# EAGLE design IO (EAGLE 7.2.0)
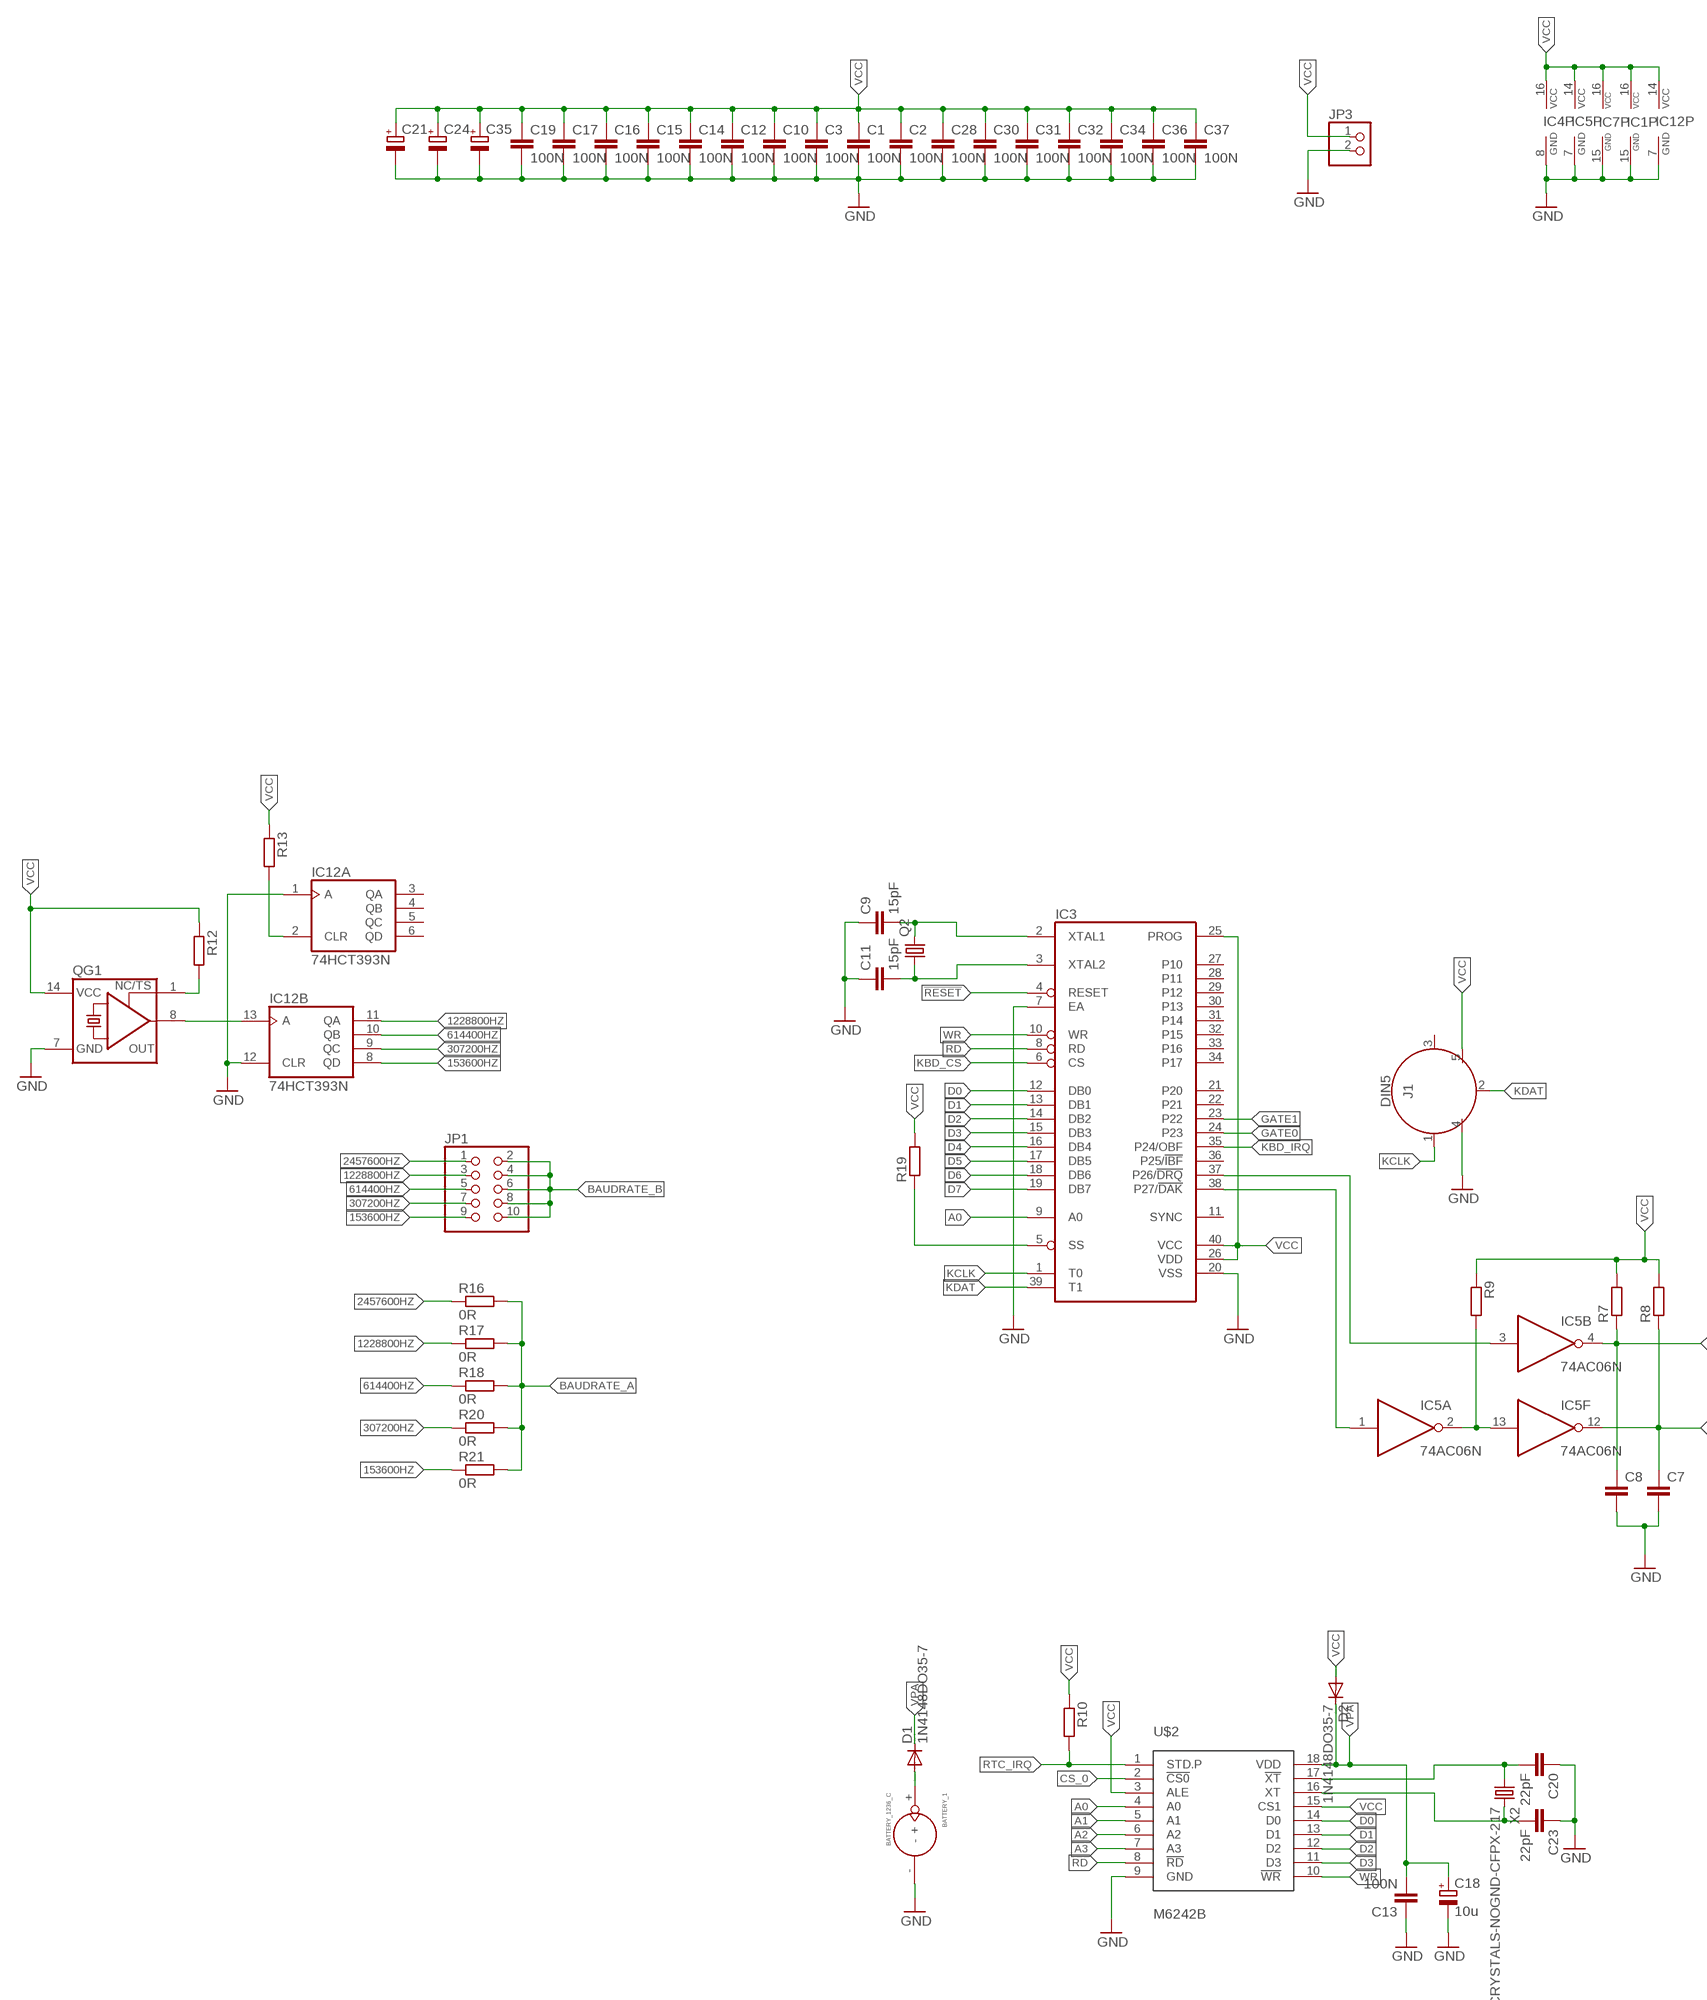
[diagram p0: schematic, sheet 1, part 1 of 3]
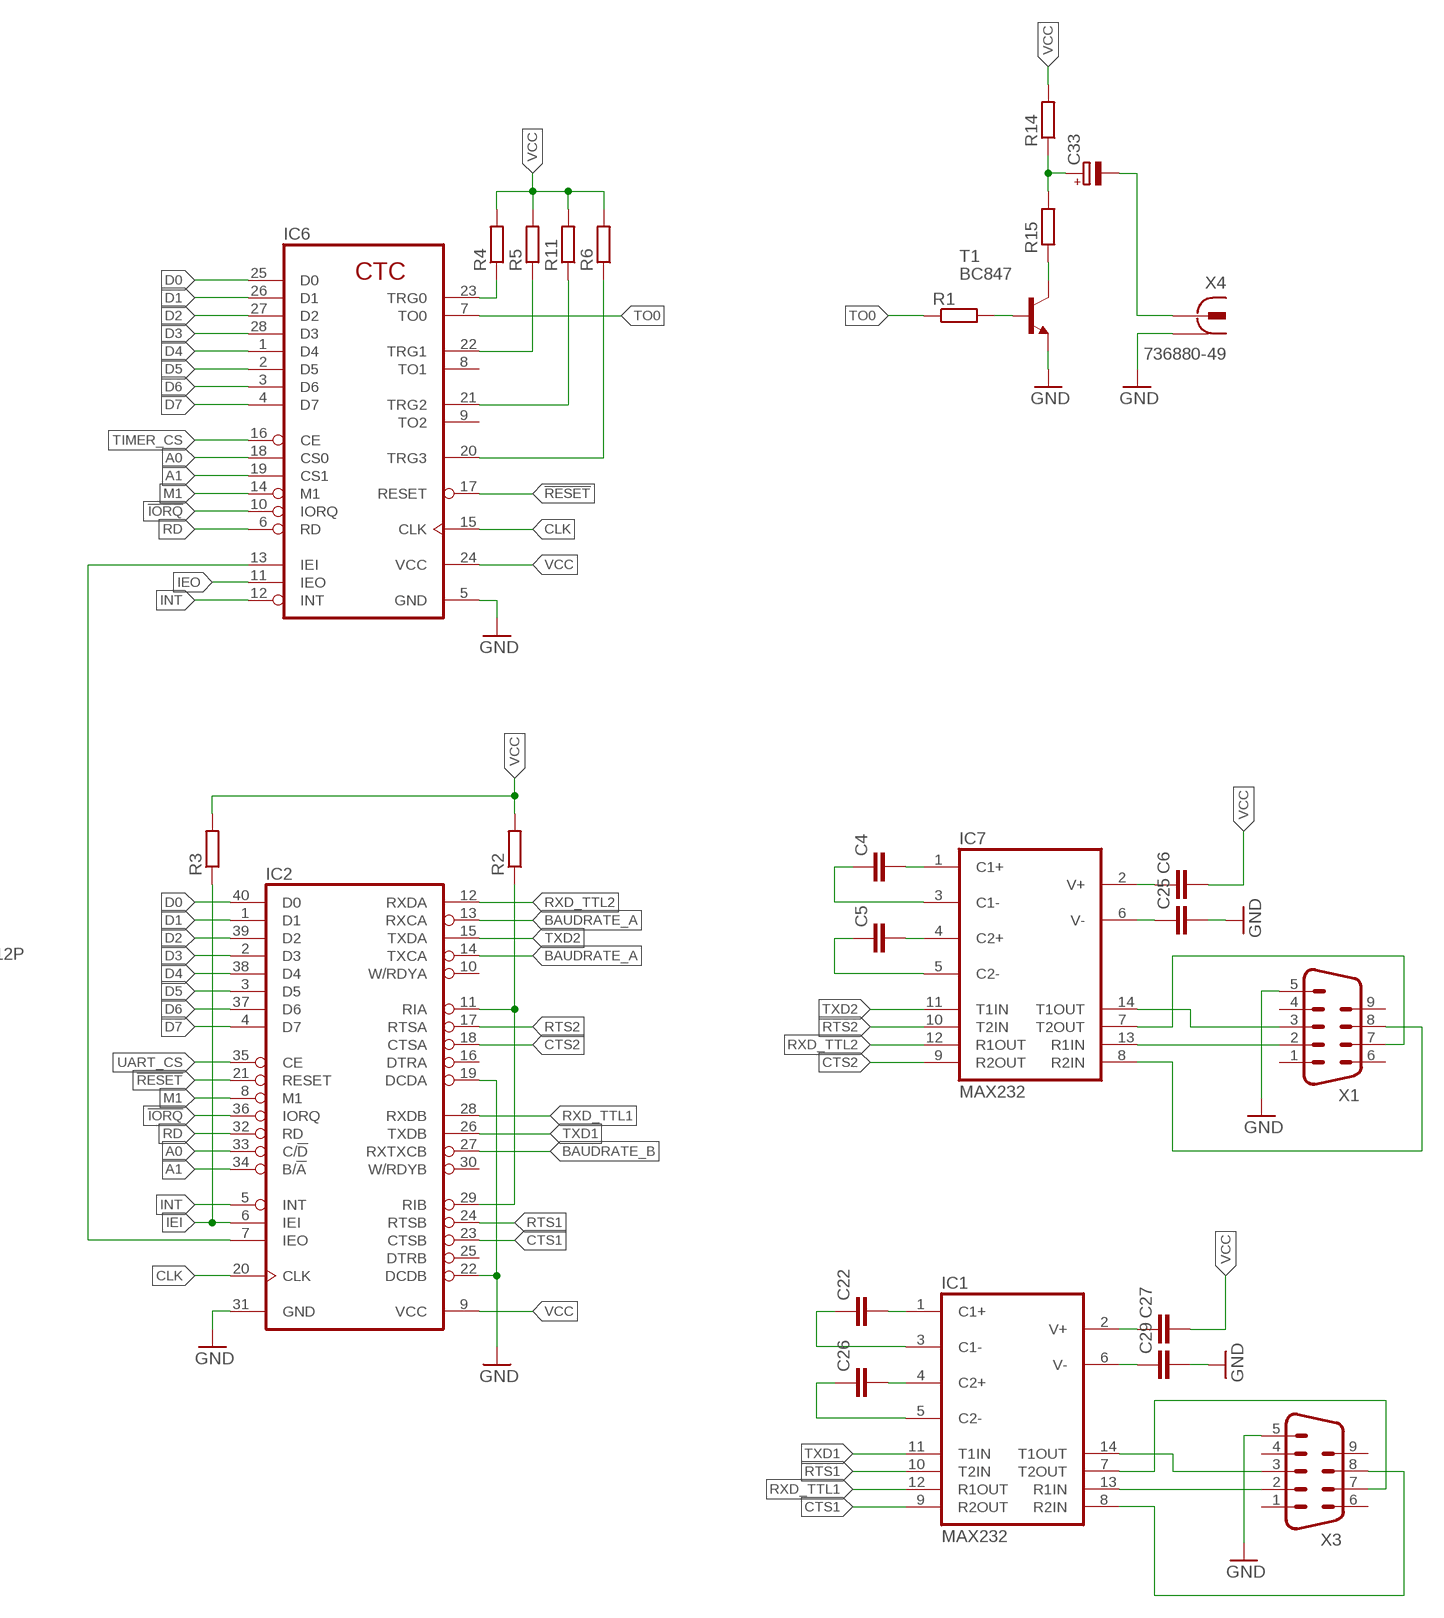
[diagram p1: schematic, sheet 1, part 2 of 3]
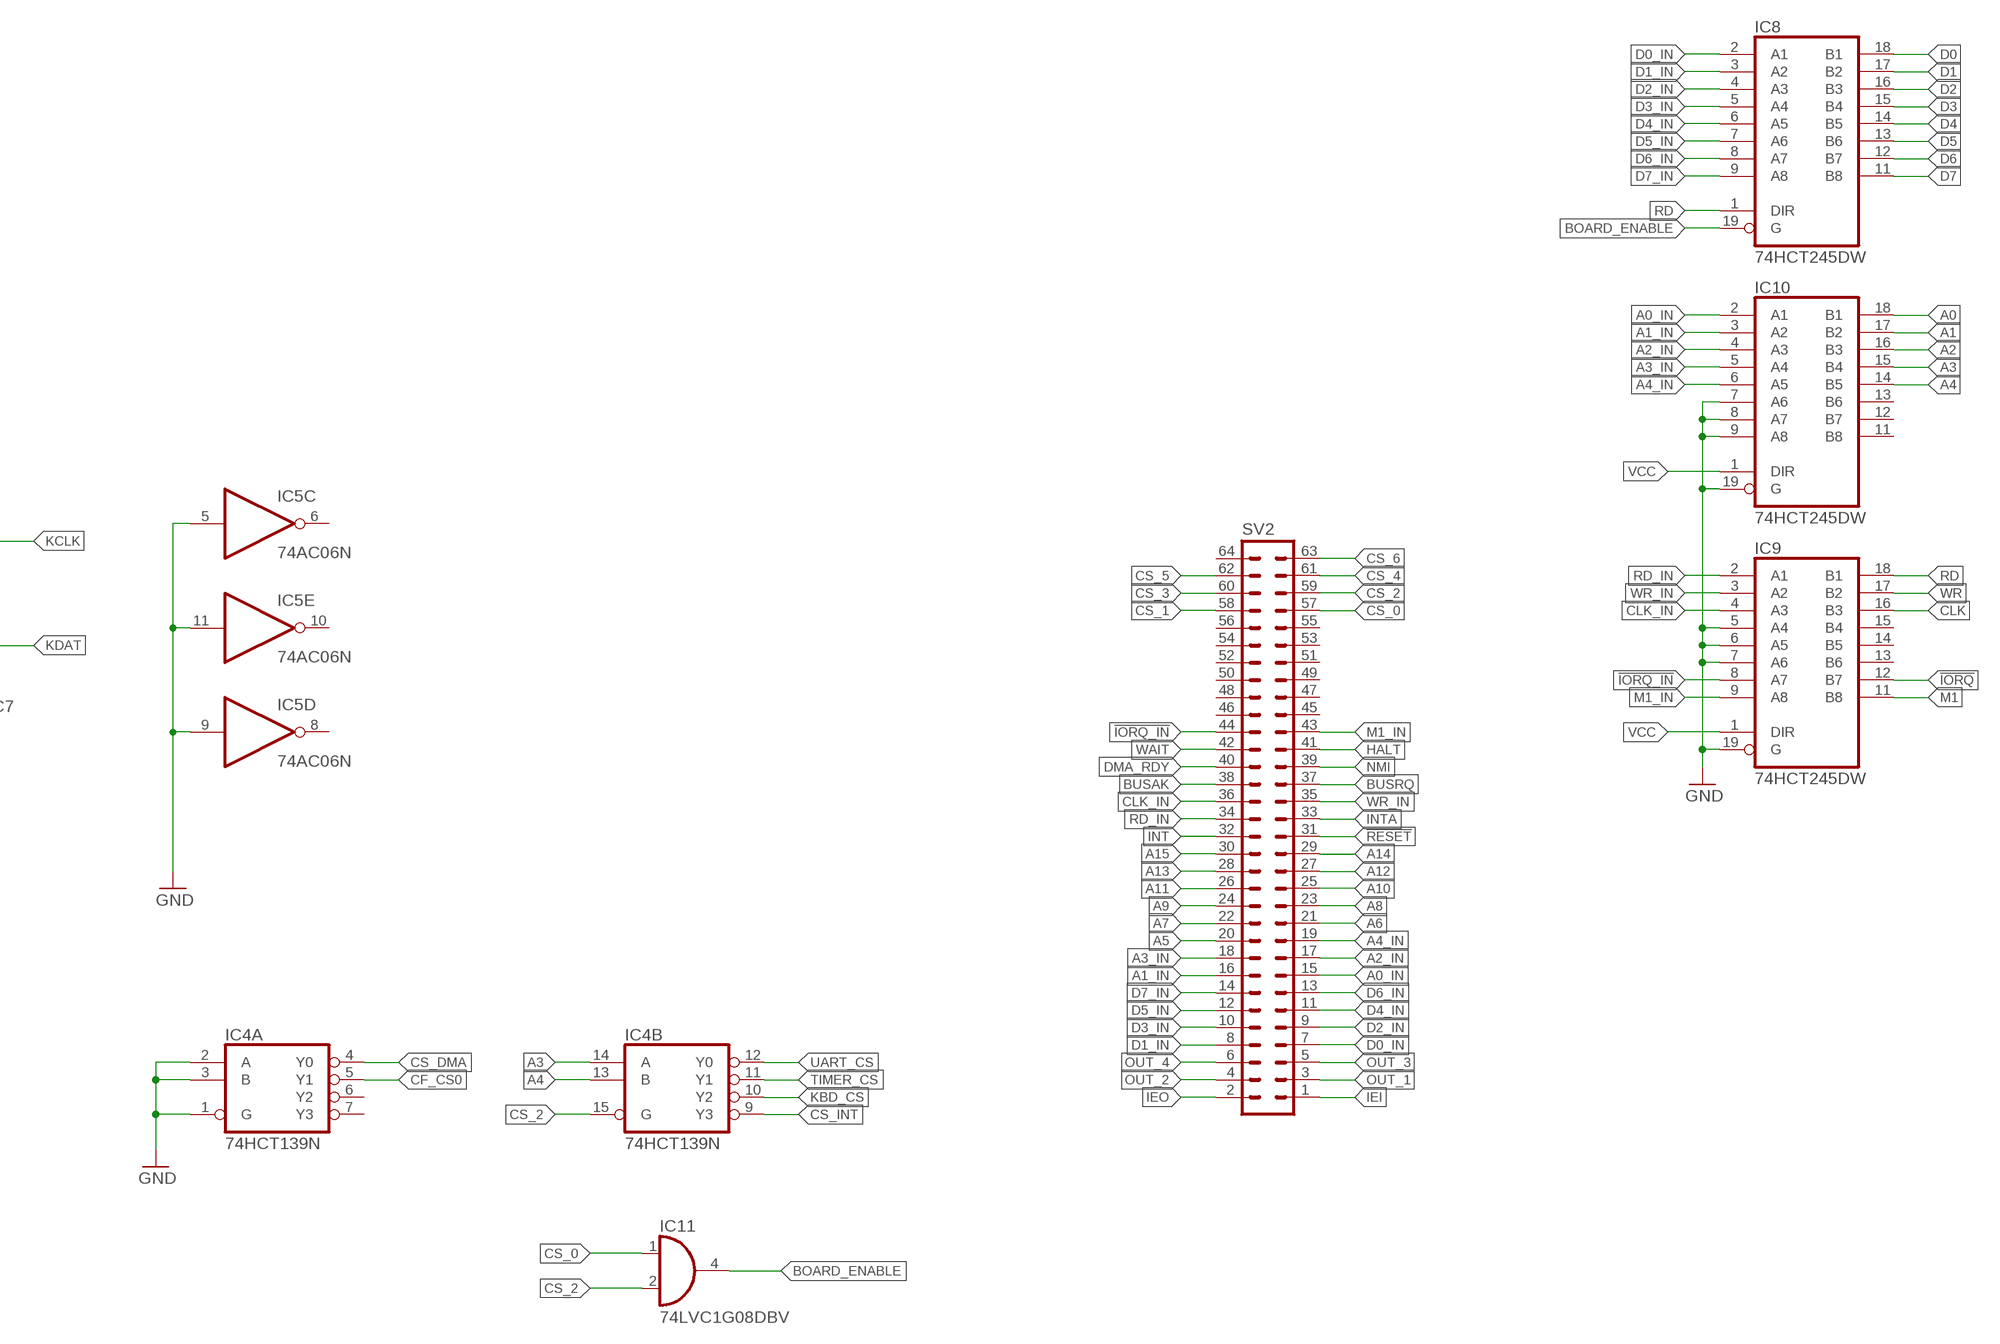
[diagram p2: schematic, sheet 1, part 3 of 3]

## Parts
BATTERY_1  BATTERY_1236_C  [BATTERY_1236_C]
C1  100N  C-EUC0603  [C0603]
C2  100N  C-EUC1206  [C1206]
C3  100N  C-EUC0603  [C0603]
C4  C-EUC0603  [C0603]
C5  C-EUC0603  [C0603]
C6  C-EUC0603  [C0603]
C7  C-EUC0603  [C0603]
C8  C-EUC0603  [C0603]
C9  15pF  C-EUC0603  [C0603]
C10  100N  C-EUC0603  [C0603]
C11  15pF  C-EUC0603  [C0603]
C12  100N  C-EUC0603  [C0603]
C13  100N  C-EUC0603  [C0603]
C14  100N  C-EUC0603  [C0603]
C15  100N  C-EUC0603  [C0603]
C16  100N  C-EUC0603  [C0603]
C17  100N  C-EUC0603  [C0603]
C18  10u  CPOL-EUSMCB  [SMC_B]
C19  100N  C-EUC0603  [C0603]
C20  22pF  C-EUC0603  [C0603]
C21  CPOL-EUSMCB  [SMC_B]
C22  C-EUC0603  [C0603]
C23  22pF  C-EUC0603  [C0603]
C24  CPOL-EUSMCB  [SMC_B]
C25  C-EUC0603  [C0603]
C26  C-EUC0603  [C0603]
C27  C-EUC0603  [C0603]
C28  100N  C-EUC0603  [C0603]
C29  C-EUC0603  [C0603]
C30  100N  C-EUC0603  [C0603]
C31  100N  C-EUC0603  [C0603]
C32  100N  C-EUC0603  [C0603]
C33  CPOL-EUE2-4  [E2-4]
C34  100N  C-EUC0603  [C0603]
C35  CPOL-EUE5-10.5  [E5-10,5]
C36  100N  C-EUC0603  [C0603]
C37  100N  C-EUC0603  [C0603]
D1  1N4148DO35-7  [DO35-7]
D2  1N4148DO35-7  [DO35-7]
IC1  MAX232  [DIL16]
IC2  Z80DART  [DIL40]
IC3  UPI-8042AH  [DIL40]
IC4  74HCT139N  [DIL16]
IC5  74AC06N  [DIL14]
IC6  Z80CTC  [DIL28]
IC7  MAX232  [DIL16]
IC8  74HCT245DW  [SO20W]
IC9  74HCT245DW  [SO20W]
IC10  74HCT245DW  [SO20W]
IC11  74LVC1G08DBV  [SOT23-5]
IC12  74HCT393N  [DIL14]
J1  DIN5  [DIN5-RA-PTH]
JP1  PINHD-2X5  [2X05]
JP3  PINHD-1X2/90  [1X02/90]
Q2  CRYSTALHC49S  [HC49/S]
QG1  XO-14  [DIL14S]
R1  R-EU_R0603  [R0603]
R2  R-EU_R0603  [R0603]
R3  R-EU_0204/5  [0204/5]
R4  R-EU_R0603  [R0603]
R5  R-EU_R0603  [R0603]
R6  R-EU_0204/5  [0204/5]
R7  R-EU_0204/7  [0204/7]
R8  R-EU_M0805  [M0805]
R9  R-EU_R0603  [R0603]
R10  R-EU_R0603  [R0603]
R11  R-EU_R0603  [R0603]
R12  R-EU_R0603  [R0603]
R13  R-EU_R0603  [R0603]
R14  R-EU_0204/7  [0204/7]
R15  R-EU_R0603  [R0603]
R16  0R  R-EU_R0603  [R0603]
R17  0R  R-EU_R0603  [R0603]
R18  0R  R-EU_R0603  [R0603]
R19  R-EU_0204/5  [0204/5]
R20  0R  R-EU_R0603  [R0603]
R21  0R  R-EU_R0603  [R0603]
SV2  ML64L  [ML64L]
T1  BC847  [SOT23]
U$2  M6242B  [DIL18]
X1  M09HP  [M09HP]
X2  CRYSTALS-NOGND-CFPX-217  [3.2X1.5-2-PAD]
X3  M09HP  [M09HP]
X4  736880-49  [736880-49]

## Nets
153600HZ: IC12.8(B:QD) JP1.9 R21.1
307200HZ: IC12.9(B:QC) JP1.7 R20.1
614400HZ: IC12.10(B:QB) JP1.5 R18.1
1228800HZ: IC12.11(B:QA) JP1.3 R17.1
2457600HZ: IC12.13(B:A) JP1.1 QG1.8(OUT) R16.1
!IORQ: IC2.36(IORQ) IC6.10(IORQ) IC9.12(B7)
!IORQ_IN: IC9.8(A7) SV2.44
!RESET: IC2.21(RESET) IC3.4(RESET) IC6.17(RESET) SV2.31
A0: IC2.33(C/!D) IC3.9(A0) IC6.18(CS0) IC10.18(B1) U$2.4(A0)
A0_IN: IC10.2(A1) SV2.15
A1: IC2.34(B/!A) IC6.19(CS1) IC10.17(B2) U$2.5(A1)
A1_IN: IC10.3(A2) SV2.16
A2: IC10.16(B3) U$2.6(A2)
A2_IN: IC10.4(A3) SV2.17
A3: IC4.14(B:A) IC10.15(B4) U$2.7(A3)
A3_IN: IC10.5(A4) SV2.18
A4: IC4.13(B:B) IC10.14(B5)
A4_IN: IC10.6(A5) SV2.19
A5: SV2.20
A6: SV2.21
A7: SV2.22
A8: SV2.23
A9: SV2.24
A10: SV2.25
A11: SV2.26
A12: SV2.27
A13: SV2.28
A14: SV2.29
A15: SV2.30
BAUDRATE_A: IC2.13(RXCA) IC2.14(TXCA) R16.2 R17.2 R18.2 R20.2 R21.2
BAUDRATE_B: IC2.27(RXTXCB) JP1.2 JP1.4 JP1.6 JP1.8 JP1.10
BOARD_ENABLE: IC8.19(G) IC11.4(O)
BUSAK: SV2.38
BUSRQ: SV2.37
CF_CS0: IC4.5(A:Y1)
CLK: IC2.20(CLK) IC6.15(CLK) IC9.16(B3)
CLK_IN: IC9.4(A3) SV2.36
CS_0: IC11.1(I0) SV2.57 U$2.2(!CS0)
CS_1: SV2.58
CS_2: IC4.15(B:G) IC11.2(I1) SV2.59
CS_3: SV2.60
CS_4: SV2.61
CS_5: SV2.62
CS_6: SV2.63
CS_DMA: IC4.4(A:Y0)
CS_INT: IC4.9(B:Y3)
CTS1: IC1.9(R2OUT) IC2.23(CTSB)
CTS1_IN: IC1.8(R2IN) X3.8
CTS2: IC2.18(CTSA) IC7.9(R2OUT)
D0: IC2.40(D0) IC3.12(DB0) IC6.25(D0) IC8.18(B1) U$2.14(D0)
D0_IN: IC8.2(A1) SV2.7
D1: IC2.1(D1) IC3.13(DB1) IC6.26(D1) IC8.17(B2) U$2.13(D1)
D1_IN: IC8.3(A2) SV2.8
D2: IC2.39(D2) IC3.14(DB2) IC6.27(D2) IC8.16(B3) U$2.12(D2)
D2_IN: IC8.4(A3) SV2.9
D3: IC2.2(D3) IC3.15(DB3) IC6.28(D3) IC8.15(B4) U$2.11(D3)
D3_IN: IC8.5(A4) SV2.10
D4: IC2.38(D4) IC3.16(DB4) IC6.1(D4) IC8.14(B5)
D4_IN: IC8.6(A5) SV2.11
D5: IC2.3(D5) IC3.17(DB5) IC6.2(D5) IC8.13(B6)
D5_IN: IC8.7(A6) SV2.12
D6: IC2.37(D6) IC3.18(DB6) IC6.3(D6) IC8.12(B7)
D6_IN: IC8.8(A7) SV2.13
D7: IC2.4(D7) IC3.19(DB7) IC6.4(D7) IC8.11(B8)
D7_IN: IC8.9(A8) SV2.14
DMA_RDY: SV2.40
GATE0: IC3.24(P23)
GATE1: IC3.23(P22)
GND: BATTERY_1.- C1.2 C2.2 C3.2 C7.2 C8.2 C9.1 C10.2 C11.1 C12.2 C13.1 C14.2 C15.2 C16.2 C17.2 C18.- C19.2 C20.1 C21.- C23.1 C24.- C25.2 C28.2 C29.2 C30.2 C31.2 C32.2 C34.2 C35.- C36.2 C37.2 IC1.15(GND) IC2.19(DCDA) IC2.22(DCDB) IC2.31(GND) IC3.7(EA) IC3.20(VSS) IC4.1(A:G) IC4.2(A:A) IC4.3(A:B) IC4.8(P:GND) IC5.5(C:I) IC5.7(P:GND) IC5.9(D:I) IC5.11(E:I) IC6.5(GND) IC7.15(GND) IC9.5(A4) IC9.6(A5) IC9.7(A6) IC9.19(G) IC10.7(A6) IC10.8(A7) IC10.9(A8) IC10.19(G) IC12.1(A:A) IC12.7(P:GND) IC12.12(B:CLR) J1.4 JP3.2 QG1.7(GND) T1.2(E) U$2.9(GND) X1.5 X3.5 X4.1 X4.1@1 X4.1@2
HALT: SV2.41
IEI: IC2.6(IEI) R3.1 SV2.1
IEO: IC6.11(IEO) SV2.2
INT: IC2.5(INT) IC6.12(INT) SV2.32
INTA: SV2.33
KBD_CS: IC3.6(CS) IC4.10(B:Y2)
KBD_IRQ: IC3.35(P24/OBF)
KCLK: C8.1 IC3.1(T0) IC5.4(B:O) J1.1 R7.1
KDAT: C7.1 IC3.39(T1) IC5.12(F:O) J1.2 R8.1
M1: IC2.8(M1) IC6.14(M1) IC9.11(B8)
M1_IN: IC9.9(A8) SV2.43
N$1: IC1.7(T2OUT) X3.7
N$2: C22.2 IC1.1(C1+)
N$3: IC3.38(P27/!DAK) IC5.1(A:I)
N$4: C26.2 IC1.4(C2+)
N$5: C26.1 IC1.5(C2-)
N$6: C22.1 IC1.3(C1-)
N$7: IC7.7(T2OUT) X1.7
N$8: IC7.13(R1IN) X1.2
N$9: C4.2 IC7.1(C1+)
N$10: C5.2 IC7.4(C2+)
N$11: C5.1 IC7.5(C2-)
N$12: C4.1 IC7.3(C1-)
N$13: C6.1 IC7.2(V+)
N$14: C25.1 IC7.6(V-)
N$15: C9.2 IC3.2(XTAL1) Q2.2
N$16: C11.2 IC3.3(XTAL2) Q2.1
N$17: IC3.37(P26/!DRQ) IC5.3(B:I)
N$18: IC7.14(T1OUT) X1.3
N$19: C27.1 IC1.2(V+)
N$20: IC5.2(A:O) IC5.13(F:I) R9.2
N$21: IC1.13(R1IN) X3.2
N$22: BATTERY_1.+ D1.A
N$26: R1.2 T1.1(B)
N$27: R15.1 T1.3(C)
N$28: IC7.8(R2IN) X1.8
N$29: C29.1 IC1.6(V-)
N$30: C33.- X4.2
N$31: IC6.22(TRG1) R5.1
N$32: IC2.7(IEO) IC6.13(IEI)
N$33: IC6.23(TRG0) R4.1
N$34: QG1.1(TS) R12.2
N$35: IC3.5(SS) R19.1
N$36: IC2.11(RIA) IC2.29(RIB) R2.1
N$38: IC6.20(TRG3) R6.1
N$39: IC6.21(TRG2) R11.1
N$40: C33.+ R14.1 R15.2
N$41: IC12.2(A:CLR) R13.2
NMI: SV2.39
OUT_1: SV2.3
OUT_2: SV2.4
OUT_3: SV2.5
OUT_4: SV2.6
RD: IC2.32(RD) IC3.8(RD) IC6.6(RD) IC8.1(DIR) IC9.18(B1) U$2.8(!RD)
RD_IN: IC9.2(A1) SV2.34
RTC_IRQ: R10.2 U$2.1(STD.P)
RTS1: IC1.10(T2IN) IC2.24(RTSB)
RTS2: IC2.17(RTSA) IC7.10(T2IN)
RXD_TTL1: IC1.12(R1OUT) IC2.28(RXDB)
RXD_TTL2: IC2.12(RXDA) IC7.12(R1OUT)
SOSCI: C20.2 U$2.17(!XT) X2.1
SOSCO: C23.2 U$2.16(XT) X2.2
TIMER_CS: IC4.11(B:Y1) IC6.16(CE)
TO0: IC6.7(TO0) R1.1
TXD1: IC1.11(T1IN) IC2.26(TXDB)
TXD1_OUT: IC1.14(T1OUT) X3.3
TXD2: IC2.15(TXDA) IC7.11(T1IN)
UART_CS: IC2.35(CE) IC4.12(B:Y0)
VCC: C1.1 C2.1 C3.1 C6.2 C10.1 C12.1 C14.1 C15.1 C16.1 C17.1 C19.1 C21.+ C24.+ C27.2 C28.1 C30.1 C31.1 C32.1 C34.1 C35.+ C36.1 C37.1 D2.A IC1.16(VCC) IC2.9(VCC) IC3.25(PROG) IC3.26(VDD) IC3.40(VCC) IC4.16(P:VCC) IC5.14(P:VCC) IC6.24(VCC) IC7.16(VCC) IC9.1(DIR) IC10.1(DIR) IC12.14(P:VCC) J1.5 JP3.1 QG1.14(VCC) R2.2 R3.2 R4.2 R5.2 R6.2 R7.2 R8.2 R9.1 R10.1 R11.2 R12.1 R13.1 R14.2 R19.2 U$2.3(ALE) U$2.15(CS1)
VPA: C13.2 C18.+ D1.C D2.C U$2.18(VDD)
WAIT: SV2.42
WR: IC3.10(WR) IC9.17(B2) U$2.10(!WR)
WR_IN: IC9.3(A2) SV2.35
Unconnected: IC2.10(W/RDYA) IC2.16(DTRA) IC2.25(DTRB) IC2.30(W/RDYB) IC3.11(SYNC) IC3.21(P20) IC3.22(P21) IC3.27(P10) IC3.28(P11) IC3.29(P12) IC3.30(P13) IC3.31(P14) IC3.32(P15) IC3.33(P16) IC3.34(P17) IC3.36(P25/!IBF) IC4.6(A:Y2) IC4.7(A:Y3) IC5.6(C:O) IC5.8(D:O) IC5.10(E:O) IC6.8(TO1) IC6.9(TO2) IC9.13(B6) IC9.14(B5) IC9.15(B4) IC10.11(B8) IC10.12(B7) IC10.13(B6) IC12.3(A:QA) IC12.4(A:QB) IC12.5(A:QC) IC12.6(A:QD) J1.3 SV2.45 SV2.46 SV2.47 SV2.48 SV2.49 SV2.50 SV2.51 SV2.52 SV2.53 SV2.54 SV2.55 SV2.56 SV2.64 X1.1 X1.4 X1.6 X1.9 X3.1 X3.4 X3.6 X3.9

## Power pins joined to a net without a drawn wire
GND: IC8.10(GND) IC9.10(GND) IC10.10(GND) IC11.3(GND)
VCC: IC8.20(VCC) IC9.20(VCC) IC10.20(VCC) IC11.5(VCC)

## Library data of the parts
BATTERY_1 = Itead_BP_110825.lbr:BATTERY_1236_C: SOC004
C1-C17 C19 C20 C22 C23 C25-C32 C34 C36 C37 = rcl:C-EU: CAPACITOR, European symbol
C18 C21 C24 C33 C35 = rcl:CPOL-EU: POLARIZED CAPACITOR, European symbol
D1 D2 = diode:1N4148: DIODE high speed (Philips)
IC1 IC7 = maxim:MAX232: RS232 TRANSCEIVER; MF: MAXIM; MPN: MAX232ACPE+; OC_FARNELL: 9723773; OC_NEWARK: 68K4544
IC2 = zilog:Z80DART: Z80 FAMILY DEVICE
IC3 = micro-intel:UPI-8042AH: MICROCOMPUTER/PERIPHERAL DEVICE; OC_FARNELL: unknown; OC_NEWARK: unknown
IC4 = 74xx-eu:74*139: Dual 2-line to 4-line DECODER/DEMULTIPLEXER
IC5 = 74xx-eu:74*06: Hex INVERTER, open collector high-voltage output
IC6 = zilog:Z80CTC: Z80 FAMILY DEVICE
IC8-IC10 = 74xx-eu:74*245: Octal BUS TRANSCEIVER, 3-state
IC11 = 74xx-little-de:74*1G08: 2-input AND gate
IC12 = 74xx-eu:74*393: Dual 4-bit decade and binary COUNTER
J1 = SparkFun-Connectors:DIN5: DIN5 Connector - Female Right Angle (frequently used as a MIDI Jack connector) This type of connector and cable is frequently used for transmitting midi data (musical instrument digital interface). It is what you usually see on a keyboard or set of electronic drums. Learn more here <https://en.wikipedia.org/wiki/MIDI>. For more information on the pinout and electrical specifications of MIDI communications, please see the following resource: https://www.midi.org/specifications/item/midi-din-electrical-specification Here is the connector we sell at SparkFun: MIDI Connector - Female Right Angle <https://www.sparkfun.com/products/9536> (PRT-09536) Datasheet <hhttp://www.sparkfun.com/datasheets/Prototyping/Connectors/MIDI-RA.pdf> It is used on this SparkFun product: SparkFun MIDI Shield <https://www.sparkfun.com/products/12898> (DEV-12898); PROD_ID: CONN-09481
JP1 = pinhead:PINHD-2X5: PIN HEADER
JP3 = pinhead:PINHD-1X2: PIN HEADER
Q2 = crystal:CRYSTAL: CRYSTAL; OC_FARNELL: 1667008; OC_NEWARK: unknown
QG1 = crystal:XO-: CRYSTAL; OC_FARNELL: unknown; OC_NEWARK: unknown
R1-R21 = rcl:R-EU_: RESISTOR, European symbol
SV2 = con-harting-ml:ML64: HARTING; OC_FARNELL: unknown; OC_NEWARK: unknown
T1 = transistor:BC847: NPN TRANSISTOR
U$2 = mw:M6242B
X1 X3 = con-subd:M09: SUB-D; OC_FARNELL: unknown; OC_NEWARK: unknown
X2 = IQD-Frequency-Products:CRYSTALS-NOGND: CRYSTALS CAN NOT GROUNDED
X4 = con-conrad:736880-49: Cinch Connector ( RCA Jack ) Cinch-Einbaukupplung 90º 72345 Vernickelt BKL Electronic Source: Conrad <http://www.conrad.de/ce/de/product/736880>

## Board
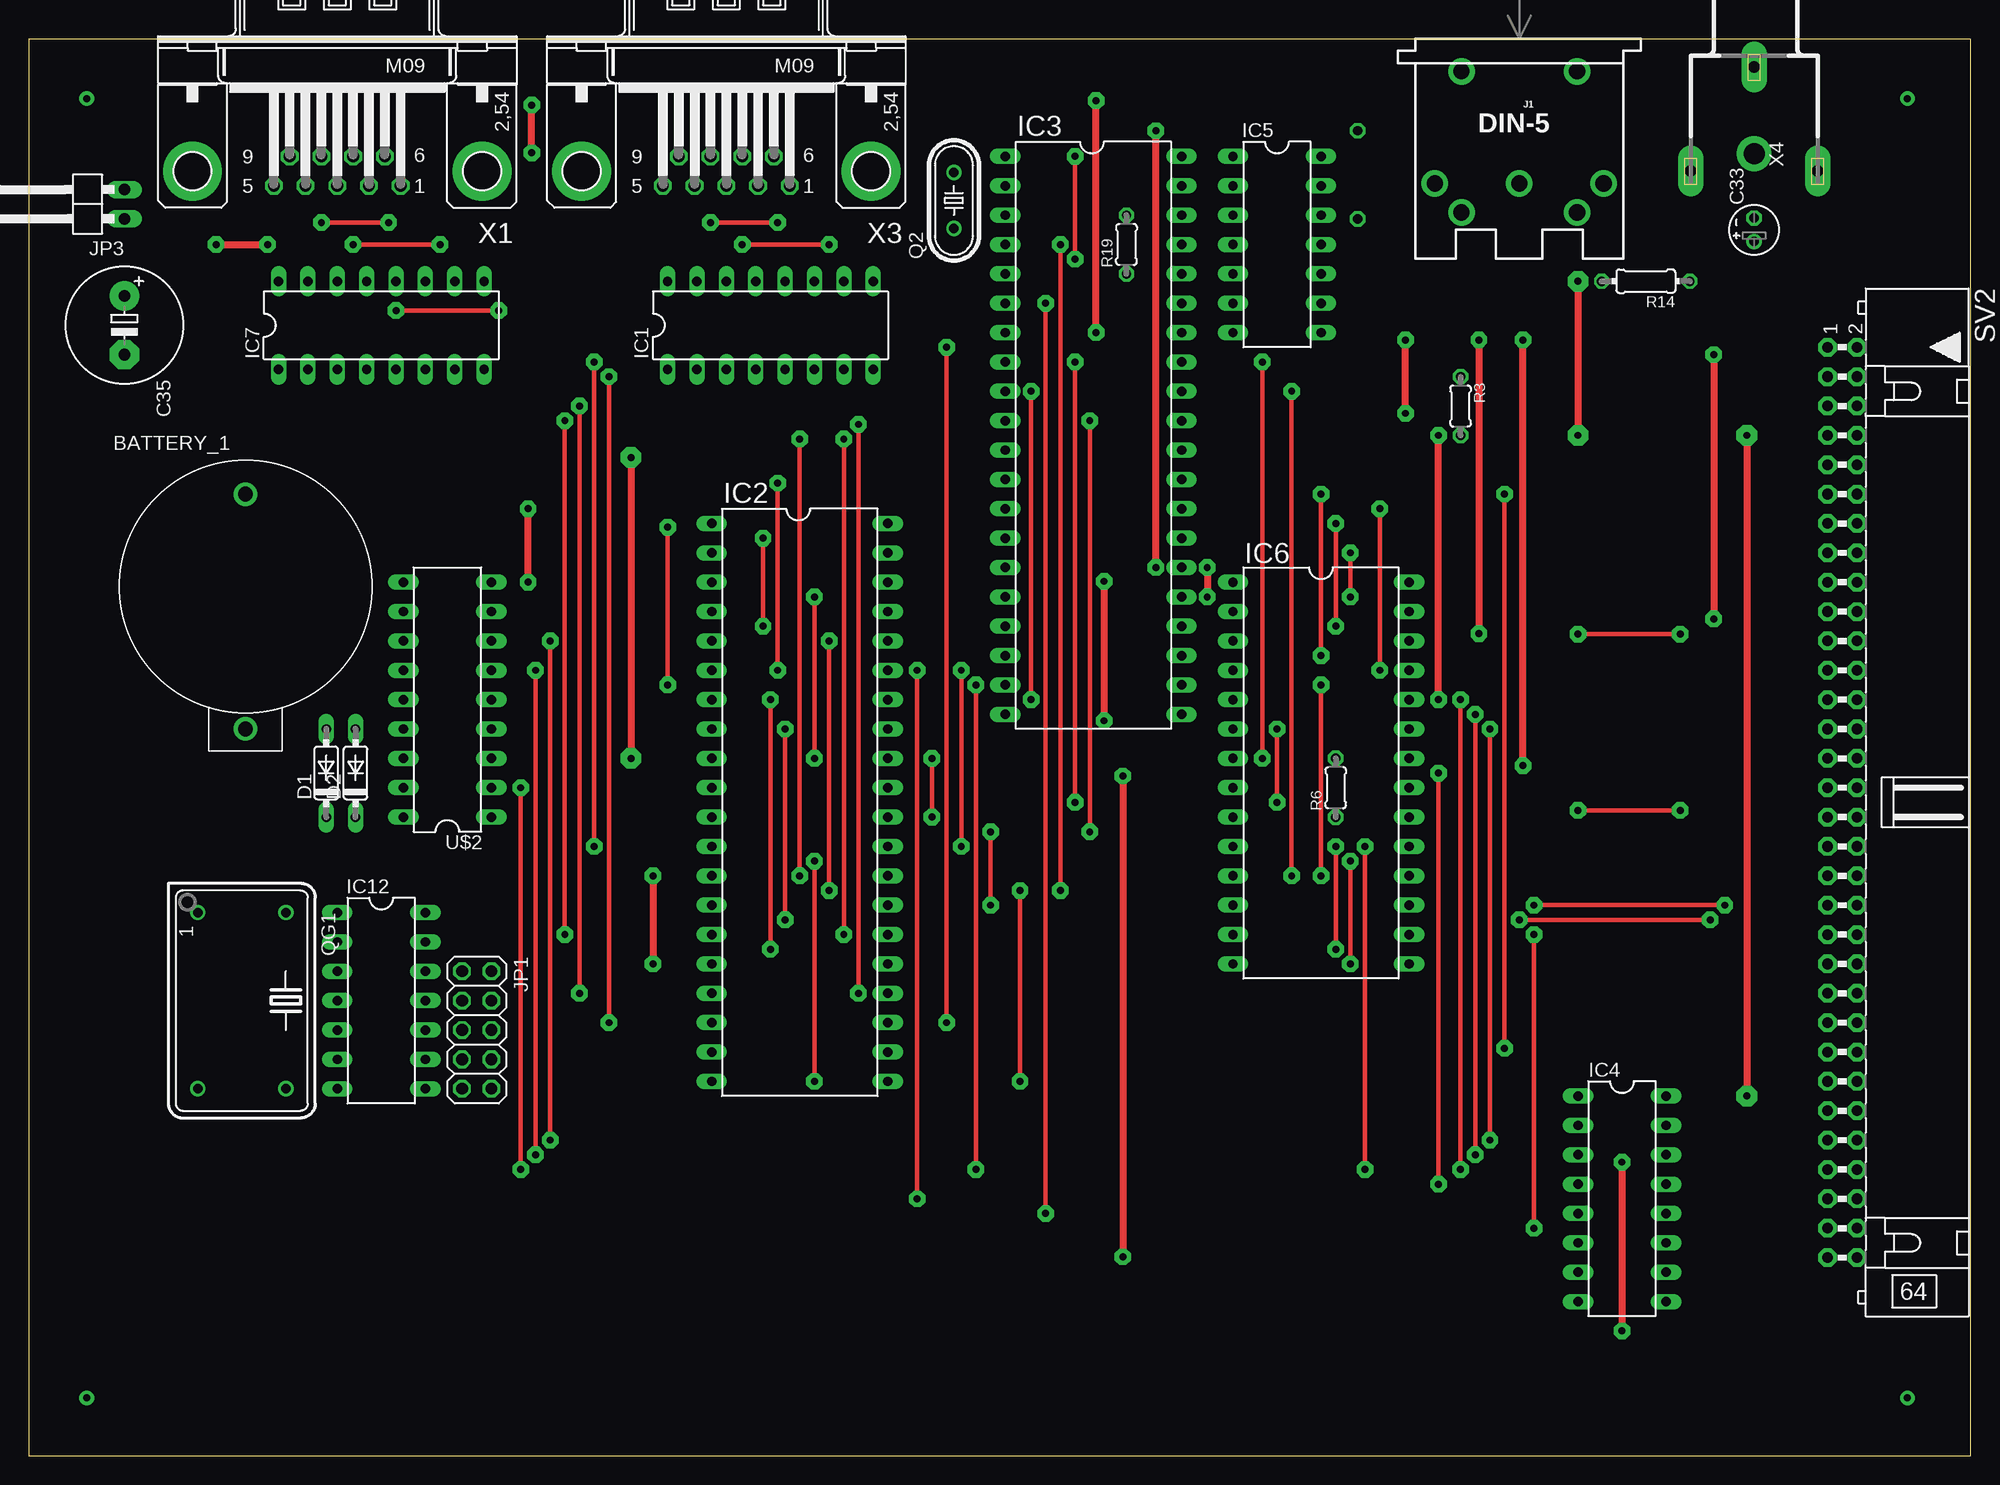
[diagram p3: board, top side]
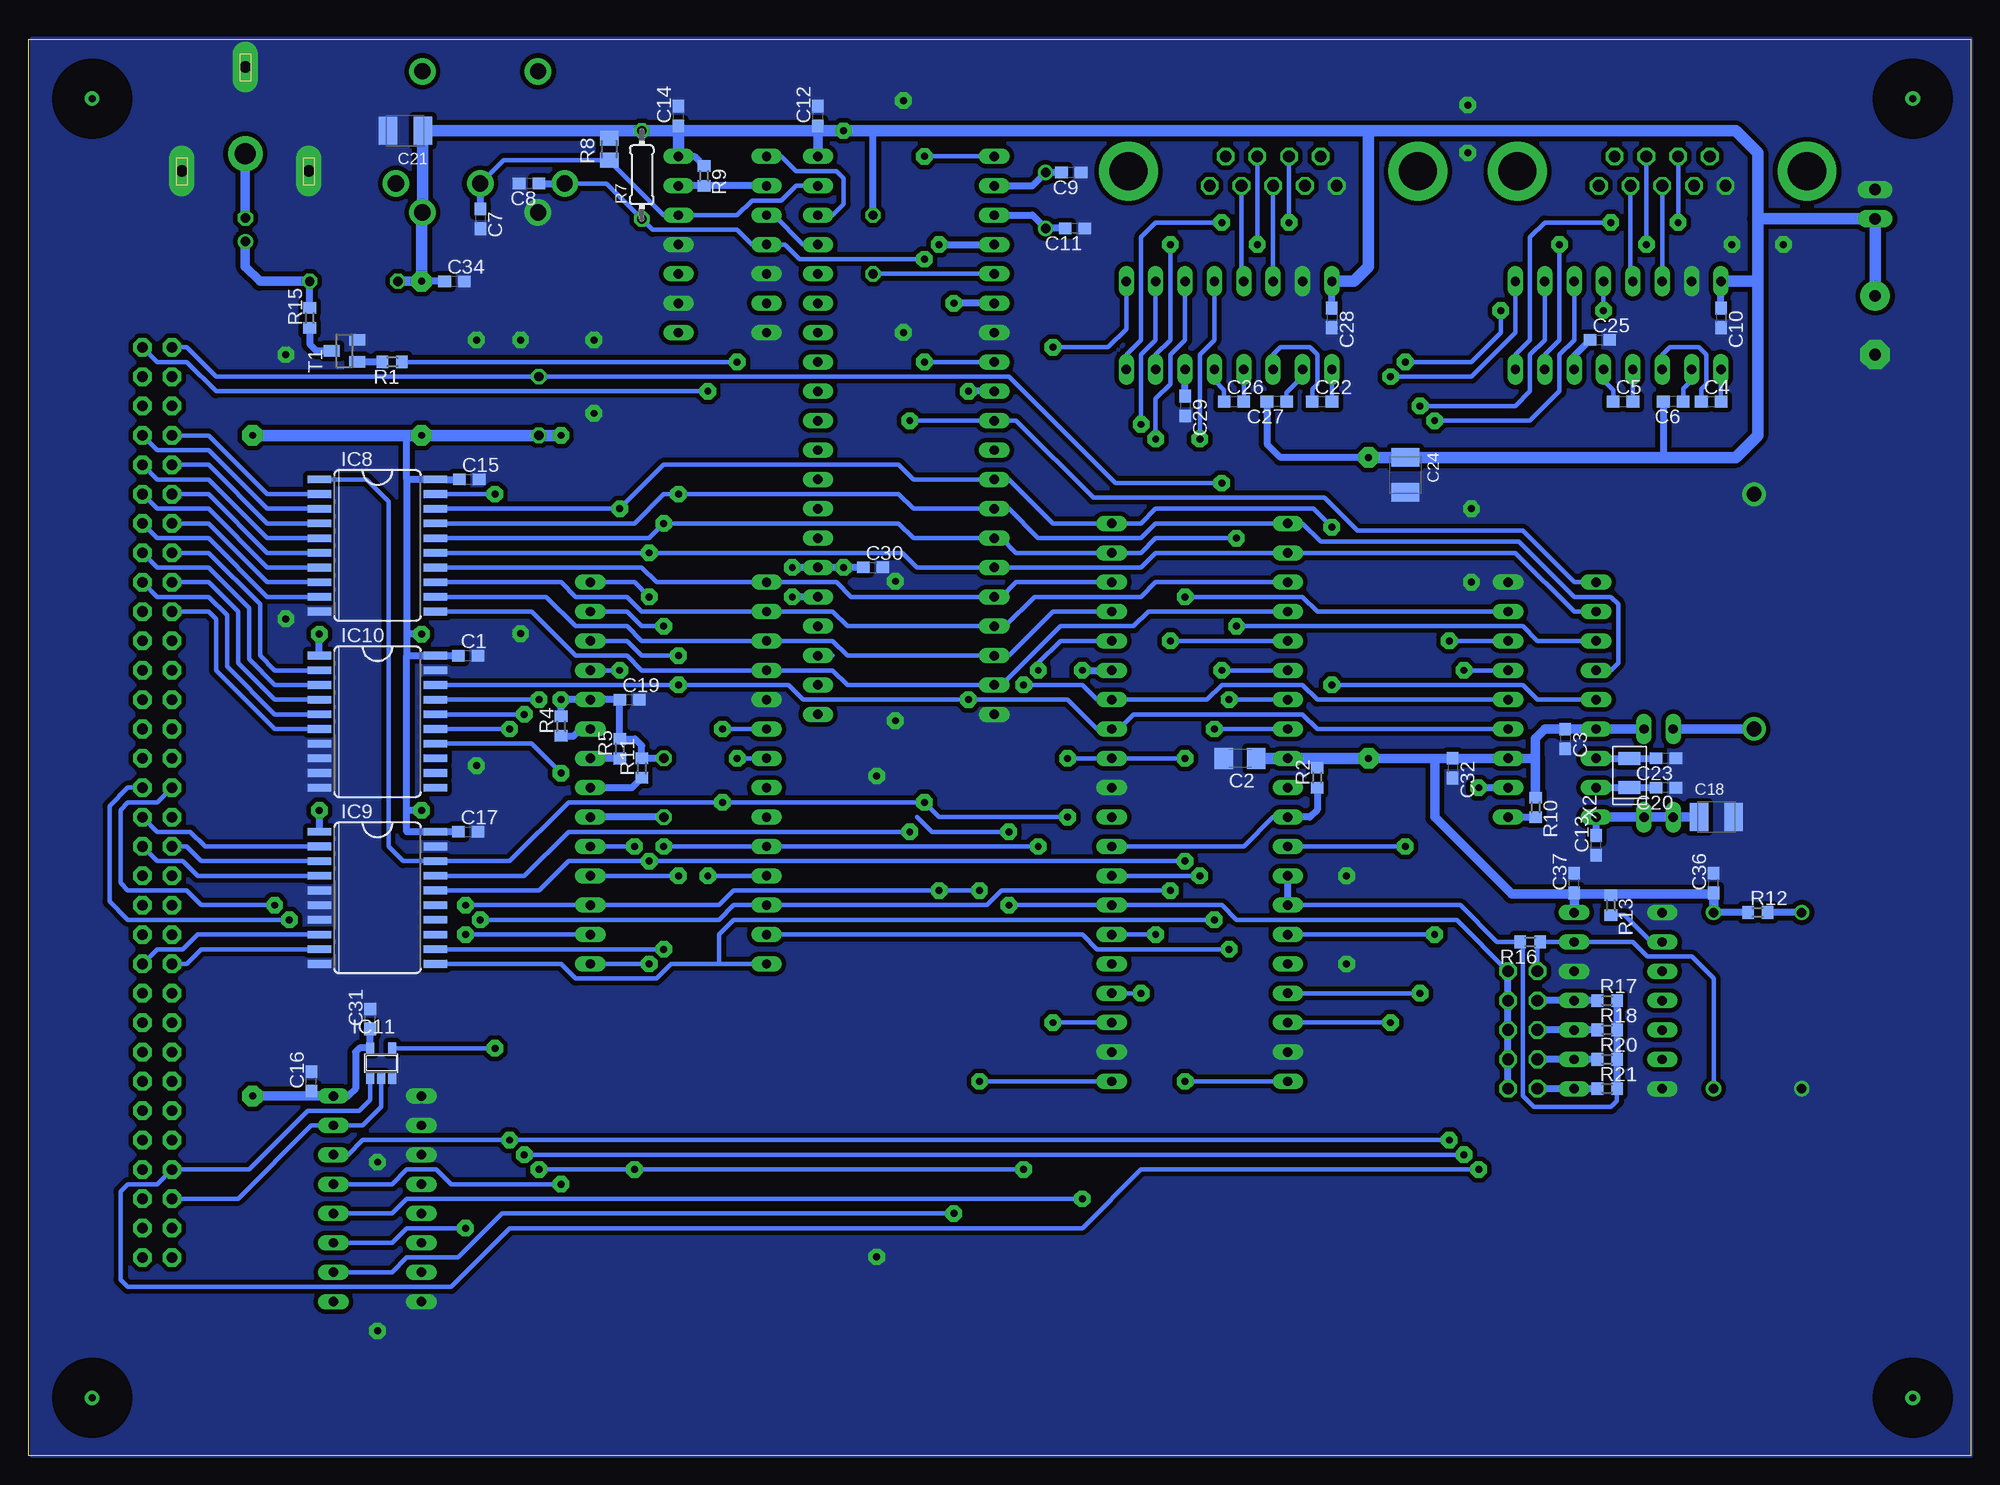
[diagram p4: board, bottom side, seen from below]

Size 167.94 x 122.55 mm. Coordinates in mm from the lower left corner, seen from the top.
Outline: 0,0 167.94,0 167.94,122.55 0,122.55 0,0
Copper layers (1*16): Top 0.035mm / dielectric 1.5mm / Bottom 0.035mm
Design rules "default *": minimum track width 10mil, minimum drill 24mil, track to track 8mil, track to pad 8mil, pad to pad 8mil, via to via 8mil, smd to smd 8mil, copper to edge 0mil, drill to drill 8mil, minimum pad ring 10mil, minimum via ring 8mil, stop-mask expansion 4mil, vias tented up to drill 0mil, thermal gap 10mil
bRestrict: area 2,2 to 8,8; area 2,114.3 to 8,120.4; area 159.4,2 to 165.5,8; area 159.4,114.3 to 165.5,120.4

### Footprints (pad centres in the part's own frame; a part is rotated, then mirrored left to right if it is on the bottom)
BATTERY_1236_C = drill 1.27 pad 2.032: + 0,0; - 0,20.32
C0603 = smd 1.1 x 1: 1 -0.85,0; 2 0.85,0
C1206 = smd 1.6 x 1.8: 1 -1.4,0; 2 1.4,0
SMC_B = smd 1.6 x 2.4: + -1.5,0; - 1.5,0
E2-4 = drill 0.813 pad 1.27: + -1.016,0 | drill 0.813 pad 1.27 octagon: - 1.016,0
E5-10,5 = drill 1.016 pad 2.54: + -2.54,0 | drill 1.016 pad 2.54 octagon: - 2.54,0
DO35-7 = drill 0.813 long: A 3.81,0; C -3.81,0
DIL16 = drill 0.813 long: 1 -8.89,-3.81; 2 -6.35,-3.81; 3 -3.81,-3.81; 4 -1.27,-3.81; 5 1.27,-3.81; 6 3.81,-3.81; 7 6.35,-3.81; 8 8.89,-3.81; 9 8.89,3.81; 10 6.35,3.81; 11 3.81,3.81; 12 1.27,3.81; 13 -1.27,3.81; 14 -3.81,3.81; 15 -6.35,3.81; 16 -8.89,3.81
DIL40 = drill 0.813 long: 1 -24.13,-7.62; 2 -21.59,-7.62; 3 -19.05,-7.62; 4 -16.51,-7.62; 5 -13.97,-7.62; 6 -11.43,-7.62; 7 -8.89,-7.62; 8 -6.35,-7.62; 9 -3.81,-7.62; 10 -1.27,-7.62; 11 1.27,-7.62; 12 3.81,-7.62; 13 6.35,-7.62; 14 8.89,-7.62; 15 11.43,-7.62; 16 13.97,-7.62; 17 16.51,-7.62; 18 19.05,-7.62; 19 21.59,-7.62; 20 24.13,-7.62; 21 24.13,7.62; 22 21.59,7.62; 23 19.05,7.62; 24 16.51,7.62; 25 13.97,7.62; 26 11.43,7.62; 27 8.89,7.62; 28 6.35,7.62; 29 3.81,7.62; 30 1.27,7.62; 31 -1.27,7.62; 32 -3.81,7.62; 33 -6.35,7.62; 34 -8.89,7.62; 35 -11.43,7.62; 36 -13.97,7.62; 37 -16.51,7.62; 38 -19.05,7.62; 39 -21.59,7.62; 40 -24.13,7.62
DIL14 = drill 0.813 long: 1 -7.62,-3.81; 2 -5.08,-3.81; 3 -2.54,-3.81; 4 0,-3.81; 5 2.54,-3.81; 6 5.08,-3.81; 7 7.62,-3.81; 8 7.62,3.81; 9 5.08,3.81; 10 2.54,3.81; 11 0,3.81; 12 -2.54,3.81; 13 -5.08,3.81; 14 -7.62,3.81
DIL28 = drill 0.813 long: 1 -16.51,-7.62; 2 -13.97,-7.62; 3 -11.43,-7.62; 4 -8.89,-7.62; 5 -6.35,-7.62; 6 -3.81,-7.62; 7 -1.27,-7.62; 8 1.27,-7.62; 9 3.81,-7.62; 10 6.35,-7.62; 11 8.89,-7.62; 12 11.43,-7.62; 13 13.97,-7.62; 14 16.51,-7.62; 15 16.51,7.62; 16 13.97,7.62; 17 11.43,7.62; 18 8.89,7.62; 19 6.35,7.62; 20 3.81,7.62; 21 1.27,7.62; 22 -1.27,7.62; 23 -3.81,7.62; 24 -6.35,7.62; 25 -8.89,7.62; 26 -11.43,7.62; 27 -13.97,7.62; 28 -16.51,7.62
SO20W = smd 0.66 x 2.032: 1 -5.715,-5.029; 2 -4.445,-5.029; 3 -3.175,-5.029; 4 -1.905,-5.029; 5 -0.635,-5.029; 6 0.635,-5.029; 7 1.905,-5.029; 8 3.175,-5.029; 9 4.445,-5.029; 10 5.715,-5.029; 11 5.715,5.029; 12 4.445,5.029; 13 3.175,5.029; 14 1.905,5.029; 15 0.635,5.029; 16 -0.635,5.029; 17 -1.905,5.029; 18 -3.175,5.029; 19 -4.445,5.029; 20 -5.715,5.029
SOT23-5 = smd 0.69 x 0.99: 1 -0.95,-1.29; 2 0,-1.29; 3 0.95,-1.29; 4 0.95,1.3; 5 -0.95,1.3
DIN5-RA-PTH = drill 1.4 pad 2.286: 1 7.3,12.5; 2 0,12.5; 3 -7.3,12.5; 4 5,15; 5 -5,15; 6 -5,2.8; 7 5,2.8
2X05 = drill 1.016 octagon: 1 -5.08,-1.27; 2 -5.08,1.27; 3 -2.54,-1.27; 4 -2.54,1.27; 5 0,-1.27; 6 0,1.27; 7 2.54,-1.27; 8 2.54,1.27; 9 5.08,-1.27; 10 5.08,1.27
1X02/90 = drill 1.016 long: 1 -1.27,-3.81; 2 1.27,-3.81
HC49/S = drill 0.813: 1 -2.413,0; 2 2.413,0
DIL14S = drill 0.813: 1 -7.62,-3.81; 7 7.62,-3.81; 8 7.62,3.81; 14 -7.62,3.81
R0603 = smd 1 x 1.1: 1 -0.85,0; 2 0.85,0
0204/5 = drill 0.813 octagon: 1 -2.54,0; 2 2.54,0
0204/7 = drill 0.813 octagon: 1 -3.81,0; 2 3.81,0
M0805 = smd 1.3 x 1.6: 1 -0.95,0; 2 0.95,0
ML64L = drill 0.914 pad 1.6 octagon: 1 -39.37,-1.27; 2 -39.37,1.27; 3 -36.83,-1.27; 4 -36.83,1.27; 5 -34.29,-1.27; 6 -34.29,1.27; 7 -31.75,-1.27; 8 -31.75,1.27; 9 -29.21,-1.27; 10 -29.21,1.27; 11 -26.67,-1.27; 12 -26.67,1.27; 13 -24.13,-1.27; 14 -24.13,1.27; 15 -21.59,-1.27; 16 -21.59,1.27; 17 -19.05,-1.27; 18 -19.05,1.27; 19 -16.51,-1.27; 20 -16.51,1.27; 21 -13.97,-1.27; 22 -13.97,1.27; 23 -11.43,-1.27; 24 -11.43,1.27; 25 -8.89,-1.27; 26 -8.89,1.27; 27 -6.35,-1.27; 28 -6.35,1.27; 29 -3.81,-1.27; 30 -3.81,1.27; 31 -1.27,-1.27; 32 -1.27,1.27; 33 1.27,-1.27; 34 1.27,1.27; 35 3.81,-1.27; 36 3.81,1.27; 37 6.35,-1.27; 38 6.35,1.27; 39 8.89,-1.27; 40 8.89,1.27; 41 11.43,-1.27; 42 11.43,1.27; 43 13.97,-1.27; 44 13.97,1.27; 45 16.51,-1.27; 46 16.51,1.27; 47 19.05,-1.27; 48 19.05,1.27; 49 21.59,-1.27; 50 21.59,1.27; 51 24.13,-1.27; 52 24.13,1.27; 53 26.67,-1.27; 54 26.67,1.27; 55 29.21,-1.27; 56 29.21,1.27; 57 31.75,-1.27; 58 31.75,1.27; 59 34.29,-1.27; 60 34.29,1.27; 61 36.83,-1.27; 62 36.83,1.27; 63 39.37,-1.27; 64 39.37,1.27
SOT23 = smd 1 x 1.4: 1 -0.95,-1.1; 2 0.95,-1.1; 3 0,1.1
DIL18 = drill 0.813 long: 1 -10.16,-3.81; 2 -7.62,-3.81; 3 -5.08,-3.81; 4 -2.54,-3.81; 5 0,-3.81; 6 2.54,-3.81; 7 5.08,-3.81; 8 7.62,-3.81; 9 10.16,-3.81; 10 10.16,3.81; 11 7.62,3.81; 12 5.08,3.81; 13 2.54,3.81; 14 0,3.81; 15 -2.54,3.81; 16 -5.08,3.81; 17 -7.62,3.81; 18 -10.16,3.81
M09HP = drill 1.016 octagon: 1 -5.486,1.27; 2 -2.743,1.27; 3 0,1.27; 4 2.743,1.27; 5 5.486,1.27; 6 -4.115,-1.27; 7 -1.372,-1.27; 8 1.372,-1.27; 9 4.115,-1.27 | drill 3.302 pad 5.08: G1 -12.522,0; G2 12.522,0
3.2X1.5-2-PAD = smd 1.1 x 1.9: 1 -1.25,0; 2 1.25,0
736880-49 = drill 1 pad 2.2 long: 1 -3.92,0; 1@1 5.08,-5.5; 1@2 5.08,5.5 | drill 1.8 pad 3: 2 3.58,0

### Placement (x,y rotation side)
BATTERY_1  18.73,62.87 0 top
C1  129.96,69.22 0 bottom
C2  63.18,60.33 180 bottom
C3  35.06,62 270 bottom
C4  22.44,91.19 0 bottom
C5  30.06,91.19 0 bottom
C6  25.72,91.19 180 bottom
C7  128.91,107 270 bottom
C8  124.69,110.06 180 bottom
C9  77.79,111 180 bottom
C10  21.59,98.42 270 bottom
C11  77.47,106.17 180 bottom
C12  99.69,115.89 90 bottom
C13  32.38,52.81 90 bottom
C14  111.76,115.89 90 bottom
C15  129.86,84.45 0 bottom
C16  143.51,32.38 90 bottom
C17  129.96,53.98 0 bottom
C18  21.98,55.24 0 bottom
C19  115.99,65.41 0 bottom
C20  26.35,57.78 180 bottom
C21  135.38,114.62 180 bottom
C22  56.1,91.19 0 bottom
C23  26.35,60.33 180 bottom
C24  48.9,84.85 270 bottom
C25  32.07,96.52 0 bottom
C26  63.72,91.19 0 bottom
C27  60.01,91.19 180 bottom
C28  55.24,98.42 270 bottom
C29  67.94,90.81 270 bottom
C30  94.93,76.83 0 bottom
C31  138.43,37.78 90 bottom
C32  44.81,59.47 270 bottom
C33  149.22,106.05 90 top
C34  131.13,101.6 0 bottom
C35  8.26,97.79 270 top
C36  22.23,49.53 90 bottom
C37  34.29,49.53 90 bottom
D1  25.72,59.05 90 top
D2  28.26,59.05 90 top
IC1  64.14,97.79 0 top
IC2  66.67,56.52 270 top
IC3  92.08,88.27 270 top
IC4  137.79,22.23 270 top
IC5  107.95,104.78 270 top
IC6  111.76,59.05 270 top
IC7  30.48,97.79 0 top
IC8  137.79,78.74 270 bottom
IC9  137.79,48.26 270 bottom
IC10  137.79,63.5 270 bottom
IC11  137.48,33.97 0 bottom
IC12  30.48,39.37 270 top
J1  128.91,122.56 180 top
JP1  38.73,36.83 270 top
JP3  4.45,108.27 90 top
Q2  80.01,108.58 90 top
QG1  18.41,39.37 270 top
R1  136.53,94.61 180 bottom
R2  56.52,58.65 90 bottom
R3  123.83,90.81 270 top
R4  121.92,63.12 90 bottom
R5  116.84,61.16 90 bottom
R6  113.03,57.78 90 top
R7  114.94,110.81 90 bottom
R8  117.75,113.04 90 bottom
R9  109.54,110.71 270 bottom
R10  37.63,56.08 270 bottom
R11  114.94,59.49 90 bottom
R12  18.41,46.99 0 bottom
R13  31.11,47.62 270 bottom
R14  139.85,101.6 180 top
R15  143.66,98.42 90 bottom
R16  38.1,44.45 180 bottom
R17  31.43,39.37 0 bottom
R18  31.43,36.83 0 bottom
R19  94.93,104.78 90 top
R20  31.43,34.29 0 bottom
R21  31.43,31.75 0 bottom
SV2  156.84,56.52 270 top
T1  140.65,95.57 90 bottom
U$2  36.2,65.41 90 top
X1  26.67,111.12 180 top
X2  29.53,59.05 90 bottom
X3  60.33,111.12 180 top
X4  149.22,116.2 270 top

### Tracks (layer width: path | path; a pad name or v marks a point on that pad's centre or on a via)
153600HZ
  Bottom 0.61: JP1.9 IC12.8 R21.1
307200HZ
  Bottom 0.61: JP1.7 IC12.9 R20.1
614400HZ
  Bottom 0.61: JP1.5 IC12.10 R18.1
1228800HZ
  Bottom 0.61: JP1.3 IC12.11 R17.1
2457600HZ
  Bottom 0.406: QG1.8 22.23,41.27 24.13,43.18 27.94,43.18 29.21,44.45 IC12.13 R16.1 37.47,44.45 JP1.1
!IORQ  (via drill 0.6 pad 1.42)
  Top 0.406: v80.64,52.7 v80.64,67.94 | v113.03,52.7 v113.03,43.81
  Bottom 0.406: v113.03,52.7 IC6.10 v80.64,52.7 | v113.03,43.81 IC9.12 | IC2.36 78.74,70.48 80.64,68.58 v80.64,67.94
!IORQ_IN
  Bottom 0.406: SV2.44 156.84,43.81 154.62,43.81 153.35,45.09 IC9.8
!RESET  (via drill 0.6 pad 1.42)
  Top 0.406: v89.22,48.9 v89.22,104.78 | v85.72,48.9 v85.72,32.38 | v130.18,47.62 v146.69,47.62
  Bottom 0.406: v85.72,32.38 IC2.21 | v85.72,48.9 v89.22,48.9 107,48.9 108.27,47.62 IC6.17 v130.18,47.62 | SV2.31 156.84,56.52 159.38,56.52 160.02,55.88 160.02,49.53 159.38,48.9 154.31,48.9 153.03,47.62 v146.69,47.62
  Bottom 0.61: v89.22,104.78 IC3.4
A0  (via drill 0.6 pad 1.42)
  Top 0.406: v86.68,65.41 v86.68,92.08 | v111.76,50.16 v111.76,66.67
  Bottom 0.406: U$2.4 56.52,62.87 57.78,64.14 72.39,64.14 73.66,62.87 IC2.33 75.56,62.87 78.11,65.41 v86.68,65.41 100.97,65.41 102.23,66.67 v111.76,66.67 IC10.18 | IC6.18 v111.76,50.16
  Bottom 0.61: IC3.9 v86.68,92.08
A0_IN
  Bottom 0.406: SV2.15 152.4,78.11 147.96,73.66 147.96,69.22 146.69,67.94 IC10.2
A1  (via drill 0.6 pad 1.42)
  Top 0.406: v81.92,24.77 v81.92,66.67 | v123.83,65.41 v123.83,24.77 | v115.57,52.7 v115.57,24.77
  Bottom 0.406: U$2.5 56.52,65.41 57.78,66.67 64.77,66.67 66.04,65.41 IC2.34 75.56,65.41 76.83,66.67 v81.92,66.67 | IC10.17 v123.83,65.41 | IC6.19 v115.57,52.7 | v81.92,24.77 v115.57,24.77 v123.83,24.77
A1_IN
  Bottom 0.406: IC10.3 146.69,66.67 148.91,68.9 148.91,73.34 152.4,76.83 156.84,76.83 SV2.16
A2  (via drill 0.6 pad 1.42)
  Top 0.406: v125.09,64.14 v125.09,26.04 | v43.81,67.94 v43.81,26.04
  Bottom 0.406: v125.09,26.04 v43.81,26.04 | U$2.6 v43.81,67.94 | IC10.16 v125.09,64.14
A2_IN
  Bottom 0.406: IC10.4 146.69,65.41 149.86,68.58 149.86,73.03 152.4,75.56 SV2.17
A3  (via drill 0.6 pad 1.42)
  Top 0.406: v126.36,62.87 v126.36,27.3 | v45.09,70.48 v45.09,27.3
  Bottom 0.406: IC4.14 140.34,26.04 139.06,27.3 v126.36,27.3 v45.09,27.3 | IC10.15 v126.36,62.87 | U$2.7 v45.09,70.48
A3_IN
  Bottom 0.406: IC10.5 146.69,64.14 150.81,68.26 150.81,72.71 152.4,74.3 156.84,74.3 SV2.18
A4  (via drill 0.6 pad 1.42)
  Top 0.406: v121.92,59.05 v121.92,23.5
  Bottom 0.406: v121.92,23.5 131.44,23.5 132.72,24.77 135.25,24.77 136.53,23.5 IC4.13 | IC10.14 124.46,61.59 v121.92,59.05
A4_IN
  Bottom 0.406: IC10.6 146.69,62.87 151.76,67.94 151.76,72.39 152.4,73.03 SV2.19
BAUDRATE_A
  Bottom 0.406: IC2.14 44.13,47.62 40.96,44.45 R16.2 38.73,44.45 38.73,31.11 37.78,30.16 31.11,30.16 30.58,30.7 R21.2
  Bottom 0.61: R17.2 R18.2 R20.2 R21.2 | IC2.14 IC2.13
BAUDRATE_B  (via drill 0.6 pad 1.42)
  Top 0.406: v83.19,47.62 v83.19,53.98
  Bottom 0.406: v83.19,47.62 IC2.27 64.77,47.62 63.5,46.35 44.45,46.35 JP1.2 | v83.19,53.98 89.85,53.98 91.12,55.24
  Bottom 0.61: JP1.10 JP1.8 JP1.6 JP1.4 JP1.2
BOARD_ENABLE  (via drill 0.6 pad 1.42)
  Top 0.406: v127.64,83.19 v127.64,35.24
  Bottom 0.406: IC8.19 v127.64,83.19 | v127.64,35.24 136.5,35.24 IC11.4
CLK  (via drill 0.6 pad 1.42)
  Top 0.406: v114.3,42.55 v114.3,51.44 | v67.94,51.44 v67.94,32.38
  Bottom 0.406: IC6.15 v114.3,42.55 | IC2.20 v67.94,32.38 | IC9.16 123.83,48.9 121.28,51.44 v114.3,51.44 v67.94,51.44
CLK_IN
  Bottom 0.406: SV2.36 156.84,51.44 154.62,51.44 153.35,50.16 IC9.4
CS_0  (via drill 0.6 pad 1.42)
  Top 0.406: v42.55,24.77 v42.55,57.78
  Bottom 0.406: v42.55,24.77 71.75,24.77 76.83,19.68 126.36,19.68 131.44,14.61 159.38,14.61 160.02,15.24 160.02,22.86 159.38,23.5 156.84,23.5 SV2.57 148.91,24.77 143.83,29.84 139.38,29.84 138.43,30.8 IC11.1
  Bottom 0.61: v42.55,57.78 U$2.2
CS_2
  Bottom 0.406: SV2.59 149.86,22.23 143.51,28.57 IC4.15 139.06,28.57 137.48,30.16 IC11.2
CTS1  (via drill 0.6 pad 1.42)
  Top 0.406: v79.38,95.89 v79.38,37.47
  Bottom 0.406: IC2.23 v79.38,37.47 | IC1.9 73.03,97.47 74.61,95.89 v79.38,95.89
CTS1_IN  (via drill 0.6 pad 1.42)
  Top 0.406: v64.77,106.68 v58.95,106.68
  Bottom 0.406: IC1.8 73.03,95.25 71.75,96.52 71.75,105.41 70.48,106.68 v64.77,106.68 | v58.95,106.68 X3.8
CTS2  (via drill 0.6 pad 1.42)
  Top 0.406: v50.16,93.34 v50.16,37.47
  Bottom 0.406: IC7.9 39.37,97.16 43.18,93.34 v50.16,93.34 | v50.16,37.47 IC2.18
D0  (via drill 0.6 pad 1.42)
  Top 0.406: v116.84,67.94 v116.84,81.92 | v55.24,66.67 v55.24,80.33
  Bottom 0.406: IC6.25 v116.84,67.94 | U$2.14 37.47,65.41 38.73,66.67 v55.24,66.67 | v55.24,80.33 56.83,81.92 70.48,81.92 71.75,80.64 IC2.40 79.38,80.64 83.19,84.45 IC3.12 91.44,84.45 92.71,85.72 113.03,85.72 v116.84,81.92 IC8.18
D0_IN
  Bottom 0.406: IC8.2 147.32,83.19 152.4,88.27 SV2.7
D1  (via drill 0.6 pad 1.42)
  Top 0.406: v111.76,69.22 v111.76,83.19
  Bottom 0.406: IC6.26 116.2,70.48 114.94,69.22 v111.76,69.22 | U$2.13 31.11,67.94 30.48,68.58 30.48,73.66 31.11,74.3 34.29,74.3 39.05,79.06 56.2,79.06 57.78,80.64 IC2.1 70.48,80.64 71.75,79.38 80.64,79.38 83.19,81.92 IC3.13 91.44,81.92 92.71,83.19 v111.76,83.19 113.03,83.19 115.57,80.64 IC8.17
D1_IN
  Bottom 0.406: SV2.8 156.84,87 152.4,87 147.32,81.92 IC8.3
D2  (via drill 0.6 pad 1.42)
  Top 0.406: v113.03,71.75 v113.03,80.64 | v63.5,71.75 v63.5,79.38
  Bottom 0.406: IC6.27 116.2,73.03 114.94,71.75 v113.03,71.75 | U$2.12 37.47,70.48 38.73,71.75 v63.5,71.75 | v63.5,79.38 70.48,79.38 71.75,78.11 IC2.39 82.55,78.11 83.82,79.38 IC3.14 91.44,79.38 92.71,80.64 v113.03,80.64 114.3,79.38 IC8.16
D2_IN
  Bottom 0.406: IC8.4 147.32,80.64 152.4,85.72 SV2.9
D3  (via drill 0.6 pad 1.42)
  Top 0.406: v114.3,74.3 v114.3,78.11
  Bottom 0.406: IC3.15 91.12,76.83 92.39,78.11 v114.3,78.11 IC8.15 | IC3.15 83.82,76.83 | IC3.15 71.75,76.83 70.48,78.11 IC2.2 39.37,78.11 34.29,73.03 U$2.11 | IC6.28 115.57,75.56 v114.3,74.3
D3_IN
  Bottom 0.406: SV2.10 156.84,84.45 152.4,84.45 147.32,79.38 IC8.5
D4
  Bottom 0.406: IC2.38 82.55,75.56 83.82,74.3 IC3.16 96.84,74.3 98.11,75.56 IC6.1 113.67,75.56 114.94,76.83 IC8.14
D4_IN
  Bottom 0.406: IC8.6 147.32,78.11 152.4,83.19 SV2.11
D5
  Bottom 0.406: IC2.3 70.48,75.56 71.75,74.3 80.96,74.3 83.5,71.75 IC3.17 97.16,71.75 98.42,73.03 IC6.2 114.94,73.03 116.2,74.3 120.65,74.3 121.92,75.56 IC8.13
D5_IN
  Bottom 0.406: SV2.12 156.84,81.92 152.4,81.92 147.32,76.83 IC8.7
D6
  Bottom 0.406: IC2.37 79.38,73.03 83.19,69.22 IC3.18 97.16,69.22 98.42,70.48 IC6.3 114.94,70.48 116.2,71.75 120.65,71.75 123.19,74.3 IC8.12
D6_IN
  Bottom 0.406: IC8.8 147.32,75.56 152.4,80.64 SV2.13
D7
  Bottom 0.406: IC2.4 71.12,73.03 72.39,71.75 78.74,71.75 83.82,66.67 IC3.19 97.16,66.67 98.42,67.94 IC6.4 114.94,67.94 116.2,69.22 120.65,69.22 124.46,73.03 IC8.11
D7_IN
  Bottom 0.406: SV2.14 156.84,79.38 152.4,79.38 147.32,74.3 IC8.9
GATE1
  Bottom 0.406: 98.42,69.22 IC3.23
GND  (via drill 0.6 pad 1.42)
  Top 0.61: v43.18,75.56 v43.18,81.92 | v43.5,112.71 v43.5,116.84 | v145.73,95.25 v145.73,72.39 | v137.79,25.4 v137.79,10.79 | v92.3,97.16 v92.3,117.22 | v16.19,104.78 v20.64,104.78 | v125.41,96.52 v125.41,71.12 | v93,75.64 v93,63.58 | v94.61,58.8 v94.61,17.21 | v129.22,59.69 v129.22,96.52 | v119.06,90.17 v119.06,96.52 | v53.98,50.16 v53.98,42.55
  pour Bottom (isolate 0.406, no thermals): 0,122.56 0,0 167.64,0 167.64,122.56
IEI  (via drill 0.6 pad 1.42)
  Top 0.406: v64.77,67.94 v64.77,84.14
  Bottom 0.406: IC2.6 v64.77,67.94 | v64.77,84.14 73.98,84.14 83.19,93.34 R3.1 151.76,93.34 154.31,95.89 SV2.1
IEO  (via drill 0.6 pad 1.42)
  Top 0.406: v109.22,50.16 v109.22,92.08
  Bottom 0.406: IC6.11 v109.22,50.16 | v109.22,92.08 151.76,92.08 154.31,94.61 156.84,94.61 SV2.2
INT  (via drill 0.6 pad 1.42)
  Top 0.406: v69.22,48.9 v69.22,70.48 | v128.91,46.35 v145.41,46.35
  Bottom 0.406: v69.22,70.48 IC2.5 | v128.91,46.35 108.27,46.35 107,47.62 IC6.12 85.09,47.62 83.82,48.9 v69.22,48.9 | SV2.32 159.38,57.78 160.97,56.2 160.97,47.94 159.38,46.35 v145.41,46.35
KBD_CS  (via drill 0.6 pad 1.42)
  Top 0.406: v87.95,99.69 v87.95,20.95
  Bottom 0.406: IC4.10 136.53,15.88 135.25,17.14 130.81,17.14 127,20.95 v87.95,20.95
  Bottom 0.61: IC3.6 v87.95,99.69
KCLK  (via drill 0.6 pad 1.42)
  Top 0.406: v90.49,103.5 v90.49,112.39
  Bottom 0.406: v90.49,103.5 101.28,103.5 102.55,104.78 IC5.4 105.41,104.78 106.68,106.05 113.98,106.05 R7.1 117.99,110.06 J1.1 | v90.49,112.39 IC3.1
  Bottom 0.61: C8.1 J1.1
KDAT
  Bottom 0.406: J1.2 126.88,112.08 117.51,112.08 R8.1 117.5,111.78 113.03,107.31 IC5.12 106.68,107.31 105.41,108.58 102.87,108.58 101.6,109.86 IC3.39
  Bottom 0.61: J1.2 C7.1
M1  (via drill 0.6 pad 1.42)
  Top 0.406: v65.41,46.35 v65.41,62.87
  Bottom 0.406: IC2.8 v65.41,62.87 | v65.41,46.35 107,46.35 108.27,45.09 108.27,42.55 | IC6.14 108.27,42.55 | 108.27,42.55 112.39,42.55 113.67,41.27 120.65,41.27 121.92,42.55 IC9.11
M1_IN
  Bottom 0.406: SV2.43 154.31,42.55 153.03,43.81 IC9.9
N$1  (via drill 0.6 pad 1.42)
  Top 0.406: v69.22,104.78 v61.7,104.78
  Bottom 0.406: IC1.7 70.48,95.25 69.22,96.52 v69.22,104.78 | X3.7 v61.7,104.78
N$2
  Bottom 0.406: IC1.1 C22.2
N$3
  Bottom 0.406: IC3.38 98.42,107.31 97.47,108.27 97.47,110.49 98.11,111.12 101.6,111.12 102.87,112.39 IC5.1
N$4
  Bottom 0.406: C26.2 IC1.4
N$5
  Bottom 0.406: IC1.5 65.41,93.03 64.57,92.19 C26.1
N$6
  Bottom 0.406: IC1.3 60.33,95.25 59.69,95.89 57.15,95.89 56.52,95.25 56.52,92.71 56.95,92.28 C22.1
N$7  (via drill 0.6 pad 1.42)
  Top 0.406: v35.56,104.78 v28.04,104.78
  Bottom 0.406: IC7.7 36.83,95.25 35.56,96.52 v35.56,104.78 | v28.04,104.78 X1.7
N$8
  Bottom 0.406: X1.2 29.41,101.8 IC7.13
N$9
  Bottom 0.406: IC7.1 C4.2
N$10
  Bottom 0.406: C5.2 IC7.4
N$11
  Bottom 0.406: IC7.5 31.75,93.03 30.91,92.19 C5.1
N$12
  Bottom 0.406: IC7.3 26.67,95.25 26.04,95.89 23.5,95.89 22.86,95.25 22.86,92.71 23.29,92.28 C4.1
N$13
  Bottom 0.406: IC7.2 24.13,93.03 24.87,92.29 C6.1
N$14
  Bottom 0.61: IC7.6 34.29,95.15 C25.1
N$15
  Bottom 0.61: IC3.2 81.15,109.86 Q2.2 C9.2
N$16
  Bottom 0.61: IC3.3 81.15,107.31 Q2.1 C11.2
N$17
  Bottom 0.406: IC3.37 100.97,104.78 103.5,107.31 IC5.3
N$18
  Bottom 0.406: IC7.14 X1.3
N$19
  Bottom 0.406: C27.1 59.16,91.97 57.78,93.34 IC1.2
N$20
  Bottom 0.406: R9.2 109.22,109.86
  Bottom 0.61: IC5.2 109.22,109.86 IC5.13
N$21
  Bottom 0.406: X3.2 63.07,101.8 IC1.13
N$22
  Bottom 0.813: BATTERY_1.+ D1.A
N$23  (via drill 0.6 pad 1.27)
  other vias: 5,117.39
N$24  (via drill 0.6 pad 1.27)
  other vias: 162.48,5
N$25  (via drill 0.6 pad 1.27)
  other vias: 162.48,117.39
N$26
  Bottom 0.61: R1.2 T1.1
N$27
  Bottom 0.61: R15.1 143.66,96.16 143.06,95.57 T1.3
N$28  (via drill 0.6 pad 1.42)
  Top 0.406: v31.11,106.68 v25.3,106.68
  Bottom 0.406: IC7.8 39.37,95.25 38.1,96.52 38.1,105.41 36.83,106.68 v31.11,106.68 | X1.8 v25.3,106.68
N$29
  Bottom 0.61: C29.1 IC1.6
N$30
  Bottom 0.813: C33.- X4.2
N$31
  Bottom 0.61: R5.1 119.37,60.31 IC6.22
N$32  (via drill 0.6 pad 1.42)
  Top 0.406: v64.14,43.81 v64.14,65.41
  Bottom 0.406: IC6.13 76.83,45.09 75.56,43.81 v64.14,43.81 | v64.14,65.41 IC2.7
N$33
  Bottom 0.61: IC6.23 120.22,62.87 120.85,62.23 121.88,62.23 R4.1
N$34
  Bottom 0.61: QG1.1 R12.2
N$35
  Bottom 0.406: R19.1 IC3.5
N$36
  Bottom 0.406: IC2.11 60.33,55.24 62.87,52.7 IC2.29
  Bottom 0.61: R2.1 56.52,55.88 57.15,55.24 IC2.11
N$37  (via drill 0.6 pad 1.27)
  other vias: 5,5
N$38
  Bottom 0.61: R6.1 IC6.20
N$39
  Bottom 0.61: IC6.21 115.79,57.78 R11.1
N$40
  Bottom 0.61: R15.2 R14.1
  Bottom 0.813: R14.1 147.96,101.6 149.22,102.87 C33.+
N$41
  Bottom 0.406: IC12.2 27.62,44.45 29.95,46.77 R13.2
RD  (via drill 0.6 pad 1.42)
  Top 0.406: v90.49,56.52 v90.49,94.61 | v78.11,55.24 v78.11,60.33 | v107.95,56.52 v107.95,62.87 | v67.94,74.3 v67.94,60.33
  Bottom 0.406: v90.49,94.61 IC3.8 | v78.11,60.33 IC2.32 v67.94,60.33 | v107.95,62.87 IC6.6 | U$2.8 56.52,73.03 57.78,74.3 v67.94,74.3 | IC8.1 138.75,84.45 136.84,82.55 136.84,52.7 135.57,51.44 IC9.18 126.36,51.44 121.28,56.52 v107.95,56.52 v90.49,56.52 89.22,55.24 v78.11,55.24
RD_IN
  Bottom 0.406: SV2.34 156.84,53.98 153.99,53.98 152.72,52.7 IC9.2
RTC_IRQ
  Bottom 0.61: R10.2 39.99,55.23 U$2.1
RTS1  (via drill 0.6 pad 1.42)
  Top 0.406: v71.75,89.22 v71.75,40.01
  Bottom 0.406: IC1.10 70.48,96.52 71.75,95.25 v71.75,89.22 | IC2.24 v71.75,40.01
RTS2  (via drill 0.6 pad 1.42)
  Top 0.406: v47.62,90.81 v47.62,40.01
  Bottom 0.406: IC7.10 36.83,96.52 38.1,95.25 38.1,92.08 39.37,90.81 v47.62,90.81 | v47.62,40.01 IC2.17
RXD_TTL1  (via drill 0.6 pad 1.42)
  Top 0.406: v66.67,87.95 v66.67,50.16
  Bottom 0.406: IC1.12 65.41,96.52 66.67,95.25 v66.67,87.95 | v66.67,50.16 IC2.28
RXD_TTL2  (via drill 0.6 pad 1.42)
  Top 0.406: v48.9,94.61 v48.9,52.7 | v31.75,99.06 v40.64,99.06
  Bottom 0.406: v48.9,52.7 IC2.12 | IC7.12 v31.75,99.06 | v48.9,94.61 43.18,94.61 40.64,97.16 v40.64,99.06
SOSCI
  Bottom 0.61: U$2.17 29.21,57.78 | 29.21,57.78 C20.2 | X2.1 29.23,57.8 29.21,57.78
SOSCO
  Bottom 0.61: U$2.16 29.21,60.33 | 29.21,60.33 C23.2 | X2.2 29.23,60.3 29.21,60.33
TIMER_CS  (via drill 0.6 pad 1.42)
  Top 0.406: v130.18,45.09 v130.18,19.68
  Bottom 0.406: IC4.11 136.53,18.41 135.25,19.68 v130.18,19.68 | IC6.16 v130.18,45.09
TO0  (via drill 0.6 pad 1.42)
  Top 0.406: v106.68,60.33 v106.68,94.61
  Bottom 0.406: IC6.7 v106.68,60.33 | v106.68,94.61 R1.1
TXD1  (via drill 0.6 pad 1.42)
  Top 0.406: v70.48,45.09 v70.48,87.95
  Bottom 0.406: IC1.11 67.94,96.52 69.22,95.25 69.22,92.71 70.48,91.44 v70.48,87.95 | v70.48,45.09 IC2.26
TXD1_OUT
  Bottom 0.406: IC1.14 X3.3
TXD2  (via drill 0.6 pad 1.42)
  Top 0.406: v46.35,89.53 v46.35,45.09
  Bottom 0.406: IC7.11 34.29,96.52 35.56,95.25 35.56,92.08 38.1,89.53 v46.35,89.53 | v46.35,45.09 IC2.15
UART_CS  (via drill 0.6 pad 1.42)
  Top 0.406: v76.83,22.23 v76.83,67.94
  Bottom 0.406: IC4.12 136.53,20.95 135.25,22.23 v76.83,22.23
  Bottom 0.61: v76.83,67.94 IC2.35
VCC  (via drill 0.6 pad 1.42, 0.6 pad 1.78)
  Top 0.406: v142.82,71.07 v133.99,71.07 | v133.99,55.83 v142.82,55.83
  Top 0.61: v97.47,76.83 v97.47,114.62 | v101.92,76.83 v101.92,74.3 | v52.07,86.36 v52.07,60.33 | v121.92,65.41 v121.92,88.27 | v148.59,88.27 v148.59,31.11 | v133.99,101.6 v133.99,88.27
  Bottom 0.406: 111.76,114.62 C14.1 | R8.2 117.75,114.34 117.47,114.62 | C3.1 34.94,62.85 34.92,62.87 | R2.2 56.52,60.33 | C32.1 44.45,60.32 44.45,60.33 | C16.1 143.51,31.11 | R13.1 31.11,48.58
  Bottom 0.61: 133.99,107.47 J1.5 | R19.2 94.93,114.62 | IC5.14 110.38,112.39 R9.1 | C28.1 IC1.16 | C27.2 60.86,87.53 59.69,86.36 v52.07,86.36 | C6.2 26.57,86.46 26.67,86.36 | C10.1 IC7.16 | 135.25,84.45 IC8.20 C15.1 | 135.25,84.45 135.25,71.07 | 135.25,71.07 135.25,69.22 | 135.25,69.22 IC10.20 C1.1 | 135.25,55.88 135.25,53.98 IC9.20 C17.1 | 135.25,55.88 135.25,69.22 | IC10.1 v142.82,71.07 | v133.99,71.07 135.25,71.07 | v142.82,55.83 IC9.1 | v133.99,55.83 135.2,55.83 135.25,55.88 | C30.1 v97.47,76.83 IC3.26 v101.92,76.83 | IC3.25 v101.92,74.3 | 135.25,84.45 135.25,88.27 | C24.+ | R4.2 v121.92,65.41 IC6.24 C19.1 R5.2 115.53,62.01 114.94,61.42 R11.2 113.04,60.34 R6.2 | IC4.16 140.34,31.11 139.7,31.75 139.7,34.92 139.35,35.27 IC11.5 C31.1 | C34.1 v133.99,101.6 | R12.1 QG1.14 | 22.23,48.58 C36.1 | 34.29,48.58 C37.1
  Bottom 0.813: IC3.40 99.69,114.62 | 37.63,60.33 U$2.3 44.45,60.33 46.35,60.33 | 46.35,60.33 v52.07,60.33 | IC4.16 143.51,31.11 v148.59,31.11 | D2.A U$2.15 34.92,62.87 36.83,62.87 37.63,62.06 37.63,60.33 | 37.63,60.33 R10.1 | v133.99,101.6 R14.2 | IC12.14 34.29,48.58 | 34.29,48.58 31.11,48.58 22.23,48.58 QG1.14 | 34.29,48.58 39.69,48.58 46.35,55.24 46.35,60.33
  Bottom 1.016: J1.5 133.91,114.59 C21.+ 117.47,114.62 R7.2 111.76,114.62 | 99.69,114.62 v97.47,114.62 94.93,114.62 52.07,114.62 | 18.41,107 18.41,112.71 20.32,114.62 52.07,114.62 | 18.41,107 18.41,101.6 | 18.41,101.6 18.41,88.27 20.32,86.36 26.67,86.36 C24.+ v52.07,86.36 | 99.69,114.62 C12.1 | 52.07,114.62 52.07,102.87 53.34,101.6 IC1.16 | v52.07,60.33 56.52,60.33 IC2.9 C2.1 | 99.69,114.62 111.76,114.62 | IC5.14 111.76,114.62 | IC7.16 18.41,101.6 | 18.41,107 JP3.1 C35.+ | v148.59,88.27 135.25,88.27 v133.99,88.27 v121.92,88.27 R3.2 | 133.99,107.47 v133.99,101.6
VPA
  Bottom 0.61: C13.2 U$2.18
  Bottom 0.813: U$2.18 D2.C D1.C C18.+
WR  (via drill 0.6 pad 1.42)
  Top 0.406: v91.76,89.53 v91.76,53.98
  Bottom 0.406: v91.76,89.53 IC3.10 82.55,89.53 75.88,82.87 55.88,82.87 53.02,80.01 38.73,80.01 34.29,75.56 U$2.10 | v91.76,53.98 121.28,53.98 125.09,50.16 IC9.17
WR_IN
  Bottom 0.406: IC9.3 153.03,51.44 154.31,52.7 SV2.35